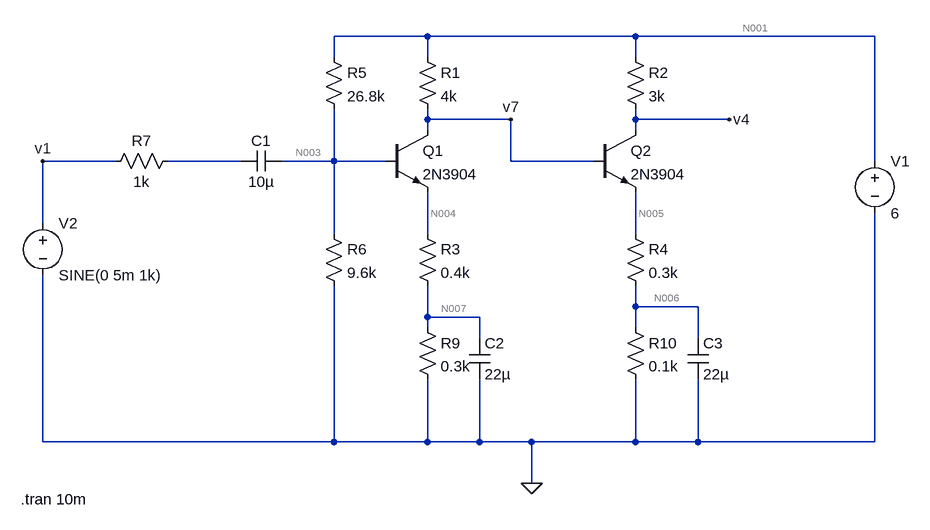
[diagram p0: schematic amp_2stage.asc]
amp_2stage.asc, the LTspice schematic file:
Version 4
SHEET 1 880 696
WIRE 128 -32 -16 -32
WIRE 448 -32 128 -32
WIRE 816 -32 448 -32
WIRE -16 0 -16 -32
WIRE 128 0 128 -32
WIRE 448 0 448 -32
WIRE 128 96 128 80
WIRE 256 96 128 96
WIRE 448 96 448 80
WIRE 592 96 448 96
WIRE 128 112 128 96
WIRE 448 112 448 96
WIRE -352 160 -464 160
WIRE -160 160 -272 160
WIRE -16 160 -16 80
WIRE -16 160 -96 160
WIRE 64 160 -16 160
WIRE 256 160 256 96
WIRE 384 160 256 160
WIRE 816 160 816 -32
WIRE -464 256 -464 160
WIRE -16 272 -16 160
WIRE 128 272 128 208
WIRE 448 272 448 208
WIRE 448 384 448 352
WIRE 544 384 448 384
WIRE 128 400 128 352
WIRE 208 400 128 400
WIRE 128 416 128 400
WIRE 448 416 448 384
WIRE 208 432 208 400
WIRE 544 432 544 384
WIRE -464 592 -464 336
WIRE -16 592 -16 352
WIRE -16 592 -464 592
WIRE 128 592 128 496
WIRE 128 592 -16 592
WIRE 208 592 208 496
WIRE 208 592 128 592
WIRE 288 592 208 592
WIRE 448 592 448 496
WIRE 448 592 288 592
WIRE 544 592 544 496
WIRE 544 592 448 592
WIRE 816 592 816 240
WIRE 816 592 544 592
WIRE 288 656 288 592
FLAG 288 656 0
FLAG -464 160 v1
FLAG 256 96 v7
FLAG 592 96 v4
SYMBOL npn 64 112 R0
SYMATTR InstName Q1
SYMATTR Value 2N3904
SYMBOL npn 384 112 R0
SYMATTR InstName Q2
SYMATTR Value 2N3904
SYMBOL res 112 -16 R0
SYMATTR InstName R1
SYMATTR Value 4k
SYMBOL res 432 -16 R0
SYMATTR InstName R2
SYMATTR Value 3k
SYMBOL res 112 256 R0
SYMATTR InstName R3
SYMATTR Value 0.4k
SYMBOL res 432 256 R0
SYMATTR InstName R4
SYMATTR Value 0.3k
SYMBOL res -32 -16 R0
SYMATTR InstName R5
SYMATTR Value 26.8k
SYMBOL res -32 256 R0
SYMATTR InstName R6
SYMATTR Value 9.6k
SYMBOL res 112 400 R0
SYMATTR InstName R9
SYMATTR Value 0.3k
SYMBOL res 432 400 R0
SYMATTR InstName R10
SYMATTR Value 0.1k
SYMBOL res -256 144 R90
WINDOW 0 0 56 VBottom 2
WINDOW 3 32 56 VTop 2
SYMATTR InstName R7
SYMATTR Value 1k
SYMBOL cap -96 144 R90
WINDOW 0 0 32 VBottom 2
WINDOW 3 32 32 VTop 2
SYMATTR InstName C1
SYMATTR Value 10µ
SYMBOL voltage 816 144 R0
WINDOW 123 0 0 Left 0
WINDOW 39 0 0 Left 0
SYMATTR InstName V1
SYMATTR Value 6
SYMBOL voltage -464 240 R0
WINDOW 123 0 0 Left 0
WINDOW 39 0 0 Left 0
SYMATTR InstName V2
SYMATTR Value SINE(0 5m 1k)
SYMBOL cap 192 432 R0
SYMATTR InstName C2
SYMATTR Value 22µ
SYMBOL cap 528 432 R0
SYMATTR InstName C3
SYMATTR Value 22µ
TEXT -498 680 Left 2 !.tran 10m

The netlist it stands for:
* amp_2stage.asc
Q1 v7 N003 N004 0 2N3904
Q2 v4 v7 N005 0 2N3904
R1 N001 v7 4k
R2 N001 v4 3k
R3 N004 N007 0.4k
R4 N005 N006 0.3k
R5 N001 N003 26.8k
R6 N003 0 9.6k
R9 N007 0 0.3k
R10 N006 0 0.1k
R7 N002 v1 1k
C1 N003 N002 10µ
V1 N001 0 6
V2 v1 0 SINE(0 5m 1k)
C2 N007 0 22µ
C3 N006 0 22µ
.model NPN NPN
.model PNP PNP
.lib standard.bjt
.tran 10m
.backanno
.end

* Results of the author's LTspice run, read from the files saved beside the schematic
* Operating Point, zero values left out:
*   V(v7) = 1.006 V
*   V(n003) = 1.538 V
*   V(n004) = 876.3 mV
*   V(v4) = 3.348 V
*   V(n005) = 354.8 mV
*   V(n001) = 6 V
*   V(n007) = 375.6 mV
*   V(n006) = 88.7 mV
*   Ic(Q1) = 1.246 mA
*   Ib(Q1) = 6.316 µA
*   Ie(Q1) = -1.252 mA
*   Ic(Q2) = 884.1 µA
*   Ib(Q2) = 2.886 µA
*   Ie(Q2) = -887 µA
*   I(R1) = 1.248 mA
*   I(R2) = 884.1 µA
*   I(R3) = 1.252 mA
*   I(R4) = 887 µA
*   I(R5) = 166.5 µA
*   I(R6) = 160.2 µA
*   I(R9) = 1.252 mA
*   I(R10) = 887 µA
*   I(V1) = -2.299 mA
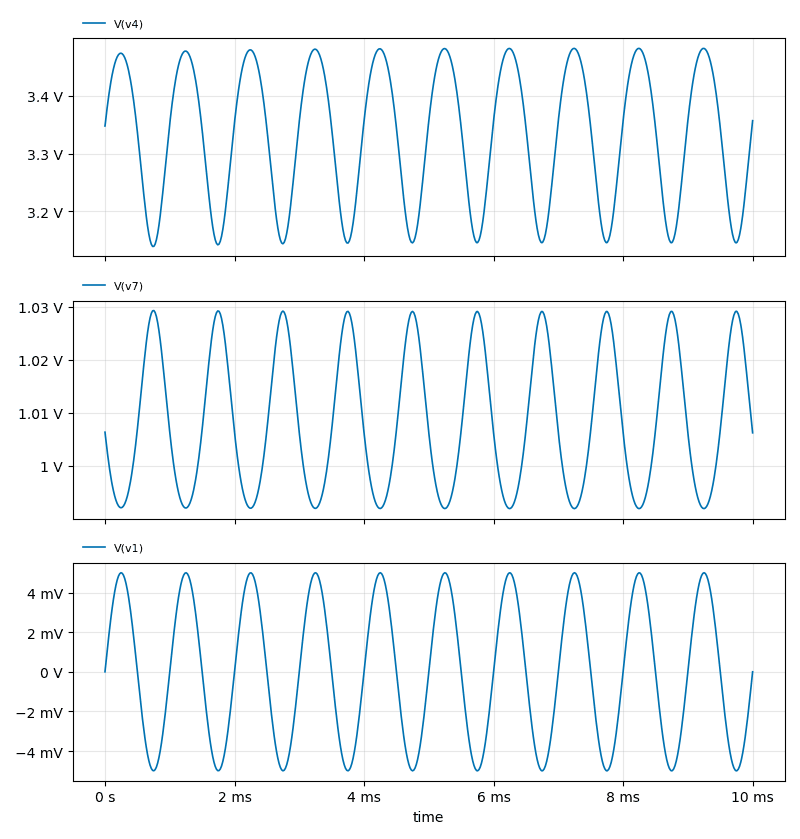
[diagram p1: Transient Analysis of amp_2stage.asc, plotted from the saved traces]
* Transient Analysis, 1 run:
*   V(v4): min 3.139 V, max 3.482 V, average 3.331 V, rms 3.333 V, last 3.357 V
*   V(v7): min 991.9 mV, max 1.029 V, average 1.009 V, rms 1.009 V, last 1.006 V
*   V(v1): min -5 mV, max 5 mV, average 60.25 nV, rms 3.534 mV, last 0 V